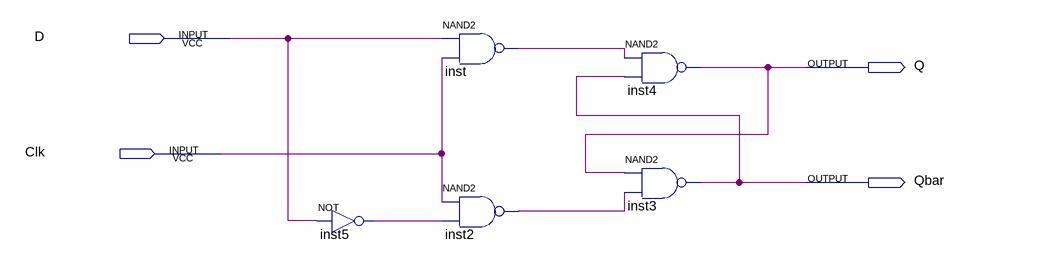
[diagram p0: schematic sheet]
// Quartus schematic D_FlipFlop_OneBit.bdf as structural Verilog: 5 symbols, 4 pins
module D_FlipFlop_OneBit (
  input  D,
  input  Clk,
  output Q,
  output Qbar
);

  wire inst2_out, inst5_out, inst_out;

  not inst5 (inst5_out, D);
  nand inst (inst_out, D, Clk);
  nand inst2 (inst2_out, Clk, inst5_out);
  nand inst4 (Q, inst_out, Qbar);
  nand inst3 (Qbar, Q, inst2_out);
endmodule
